# Altium project canable.PrjPcb
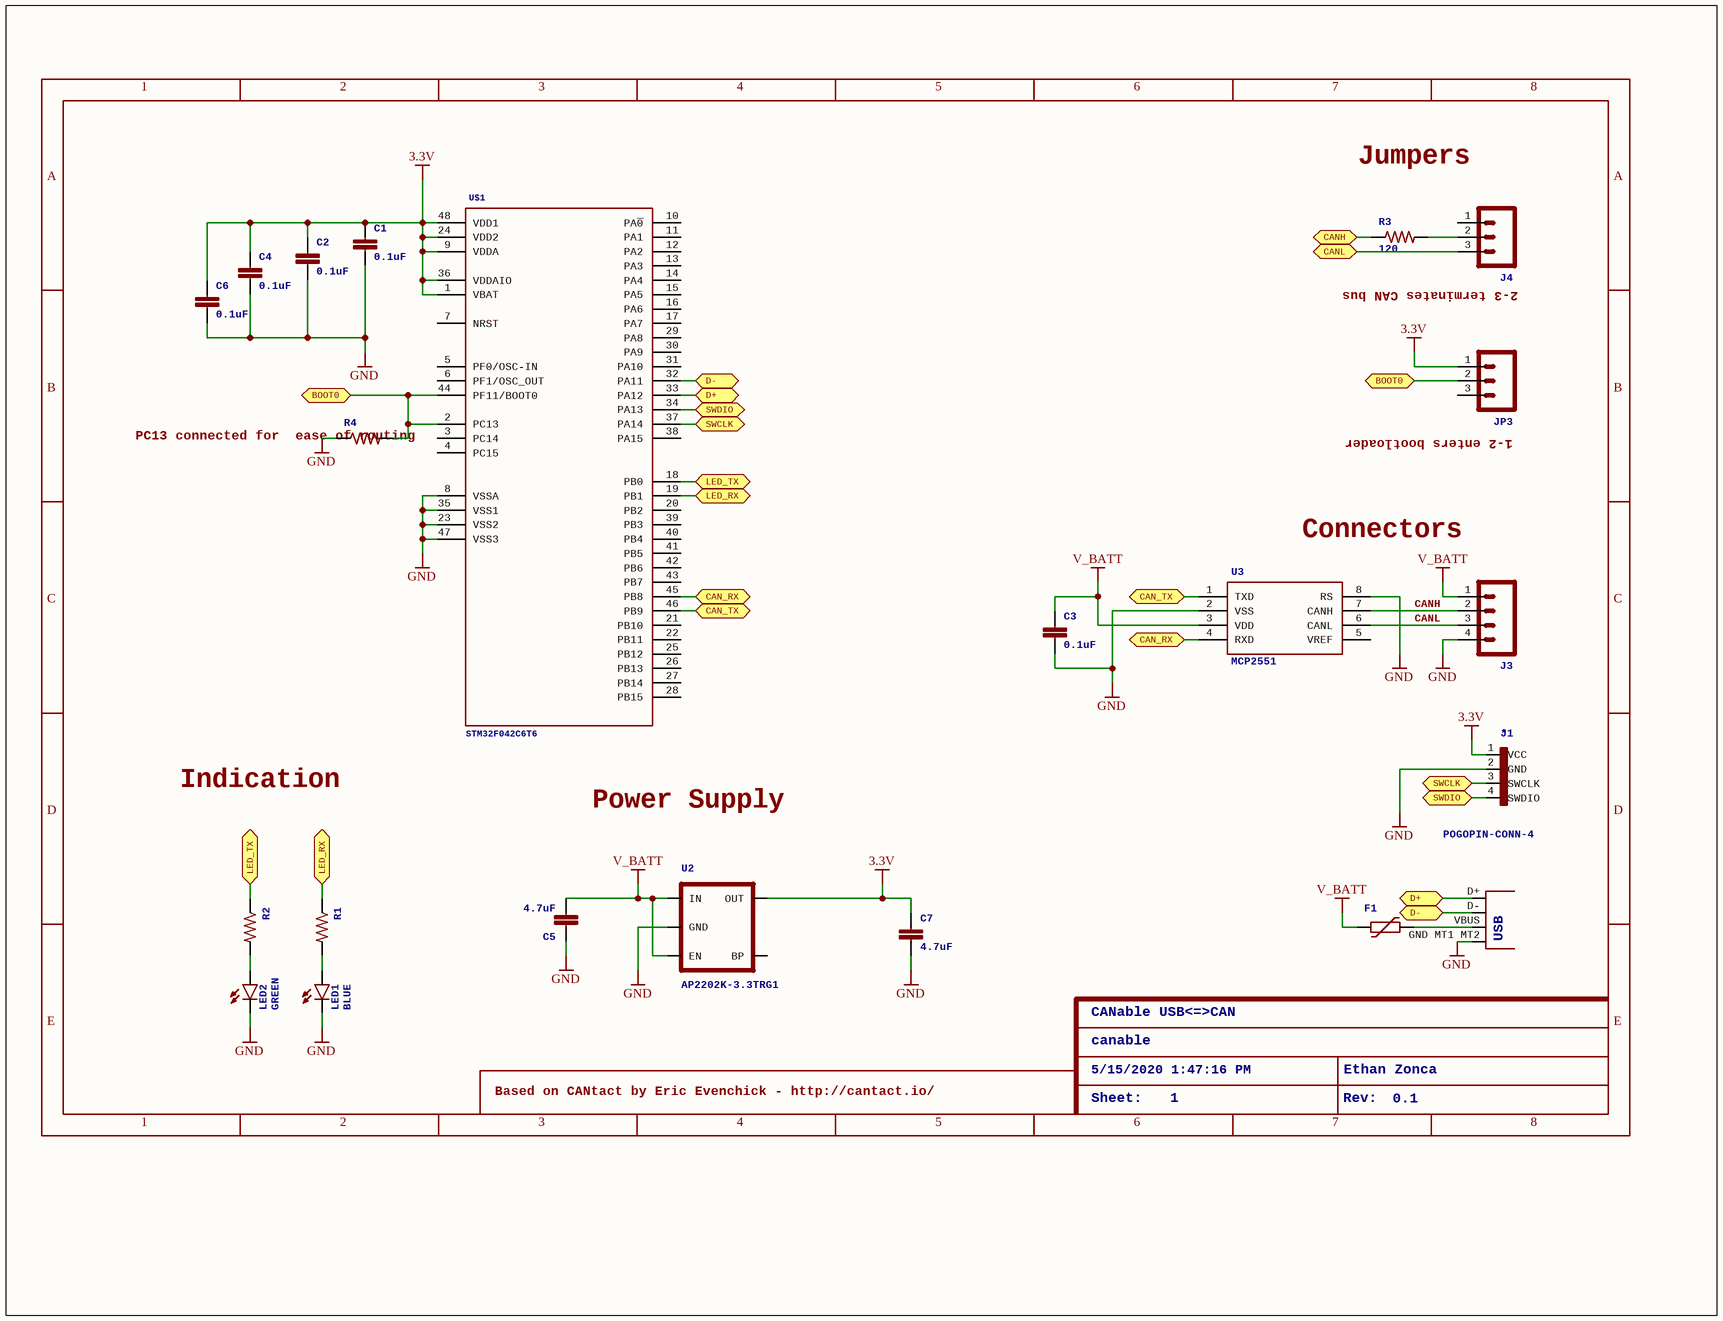
[diagram p0: canable.SchDoc]
1 sheet, 22 parts. Net scope: flat (ports and power ports of the same name join across sheets).
Board file: canable.PcbDoc

## Sheet canable.SchDoc: canable
size 302 x 231 mm; Date: 5/15/2020 1:47:16 PM; SheetNumber: 1; CNAME: CANable USB<=>CAN; CREVISION: 0.1; DESIGNER: Ethan Zonca

### Parts
C1  0.1uF  [0603-CAP]
C2  0.1uF  [0603-CAP]
C3  0.1uF  [0603-CAP]
C4  0.1uF  [0603-CAP]
C5  4.7uF  [0603-CAP]
C6  0.1uF  [0603-CAP]
C7  4.7uF  [0603-CAP]
F1  FUSE_PTC-0805  [PTC0805]  (value not drawn)
J1  POGOPIN-CONN-4  [POGOPROG-CONN-4-ALLSMT]
J2  USB-MICROB  [USB-MICROB]  (value not drawn)
J3  M04SCREW_LOCK  [SCREWTERMINAL-3.5MM-4_LOCK]  (value not drawn)
J4  M03LOCK  [1X03_LOCK]  (value not drawn)
JP3  M03LOCK  [1X03_LOCK]  (value not drawn)
LED1  BLUE  [LED-0603]
LED2  GREEN  [LED-0603]
R1  RESISTOR0603-RES  [0603-RES]  (value not drawn)
R2  RESISTOR0603-RES  [0603-RES]  (value not drawn)
R3  120  [0603-RES]
R4  RESISTOR0603-RES  [0603-RES]  (value not drawn)
U2  AP2202K-3.3TRG1  [SOT23-5]
U3  MCP2551  [SO08]
U$1  STM32F042C6T6  [LQFP48]

### Ports
BOOT0, CAN_RX, CAN_TX, CANH, CANL, D+, D-, LED_RX, LED_TX, SWCLK, SWDIO

### Nets
3.3V: C1.1 C2.1 C4.1 C6.1 C7.1 J1.1(VCC) JP3.1 U2.5(OUT) U$1.1(VBAT) U$1.9(VDDA) U$1.24(VDD2) U$1.36(VDDAIO) U$1.48(VDD1)
GND: C1.2 C2.2 C3.2 C4.2 C5.1 C6.2 C7.2 J1.2(GND) J2.GND_MT1_MT2(GND) J3.4 LED1.C LED2.C R4.1 U2.2(GND) U3.2(VSS) U3.8(RS) U$1.8(VSSA) U$1.23(VSS2) U$1.35(VSS1) U$1.47(VSS3)
V_BATT: C3.1 C5.2 F1.1 J3.1 U2.1(IN) U2.3(EN) U3.3(VDD)
CANH: J3.2 U3.7(CANH)
CANL: J3.3 U3.6(CANL)
NetF1_2: F1.2 J2.VBUS
NetJ1_3: J1.3(SWCLK) U$1.37(PA14) ; port SWCLK
NetJ1_4: J1.4(SWDIO) U$1.34(PA13) ; port SWDIO
NetJ2_D+: J2.D+ U$1.33(PA12) ; port D+
NetJ2_D-: J2.D- U$1.32(PA11) ; port D-
NetJ4_2: J4.2 R3.2
NetJ4_3: J4.3 ; port CANL
NetJP3_2: JP3.2 R4.2 U$1.2(PC13) U$1.44(PF11/BOOT0) ; port BOOT0
NetLED1_A: LED1.A R1.2
NetLED2_A: LED2.A R2.2
NetR1_1: R1.1 U$1.19(PB1) ; port LED_RX
NetR2_1: R2.1 U$1.18(PB0) ; port LED_TX
NetR3_1: R3.1 ; port CANH
NetU3_1: U3.1(TXD) U$1.46(PB9) ; port CAN_TX
NetU3_4: U3.4(RXD) U$1.45(PB8) ; port CAN_RX

Not connected (* = marked no-connect by the designer): J4 1; JP3 3; U2 4(BP); U3 5(VREF); U$1 3(PC14) 4(PC15) 5(PF0/OSC-IN) 6(PF1/OSC_OUT) 7(NRST) 10(PA~{0}) 11(PA1) 12(PA2) 13(PA3) 14(PA4) 15(PA5) 16(PA6) 17(PA7) 20(PB2) 21(PB10) 22(PB11) 25(PB12) 26(PB13) 27(PB14) 28(PB15) 29(PA8) 30(PA9) 31(PA10) 38(PA15) 39(PB3) 40(PB4) 41(PB5) 42(PB6) 43(PB7)

### Notes on the sheet
- Jumpers
- 2-3 terminates CAN bus
- (near R4) PC13 connected for
  ease of routing
- (near JP3) 1-2 enters bootloader
- Connectors
- Indication
- Power Supply
- canable
- CANable USB<=>CAN
- Based on CANtact by Eric Evenchick - http://cantact.io/
- 5/15/2020 1:47:16 PM
- Sheet:
- 1
- Rev:
- Ethan Zonca
- 0.1
- 2
- 3
- 4
- 5
- 6
- 7
- 8
- A
- B
- C
- D
- E

### Library data of the parts
C1-C7 = CAP0603-CAP: CapacitorStandard 0603 ceramic capacitor, and 0.1" leaded capacitor.
F1 = FUSE_PTC-0805: Resettable PTC
J2 = USB-MICROB: USB Connectors   USB-B-PTH is fully proven SKU : PRT-00139/CONN-08278    USB-miniB is fully proven SKU : PRT-00587    USB-A-PCB is untested.    USB-A-H is throughly reviewed, but untested. Spark Fun Electronics SKU : PRT-00437    USB-B-SMT is throughly reviewed, but untested. Needs silkscreen touching up.    USB-A-S has not been used/tested    USB-MB-H has not been used/tested    USB-MICROB has been used. CONN-09505; PROD_ID: CONN-09505; USB: USB
J3 = M04SCREW_LOCK: Header 4Standard 4-pin 0.1" header. Use with straight break away headers (SKU : PRT-00116), right angle break away headers (PRT-00553), swiss pins (PRT-00743), machine pins (PRT-00117), and female headers (PRT-00115). Molex polarized connector foot print use with SKU : PRT-08231 with associated crimp pins and housings. 1MM SMD Version SKU: PRT-10208
J4 JP3 = M03LOCK: Header 3Standard 3-pin 0.1" header. Use with straight break away headers (SKU : PRT-00116), right angle break away headers (PRT-00553), swiss pins (PRT-00743), machine pins (PRT-00117), and female headers (PRT-00115). Molex polarized connector foot print use with SKU : PRT-08232 with associated crimp pins and housings.
LED1 LED2 = LED0603: LEDsStandard schematic elements and footprints for 5mm, 3mm, 1206, and 0603 sized LEDs. 5mm - Spark Fun Electronics SKU : COM-00529 (and others)
R1-R4 = RESISTOR0603-RES: ResistorBasic schematic elements and footprints for 0603, 1206, and PTH resistors.
U2 = MIC52053.3V: MIC5205 150mA vreg 3.3V - VREG-00822 5V - VREG-00823; PROD_ID: VREG-00822
U3 = MCP2551: CAN transceiver; PROD_ID: IC-09907
J1 = POGOPIN-CONN-4: NAME: *